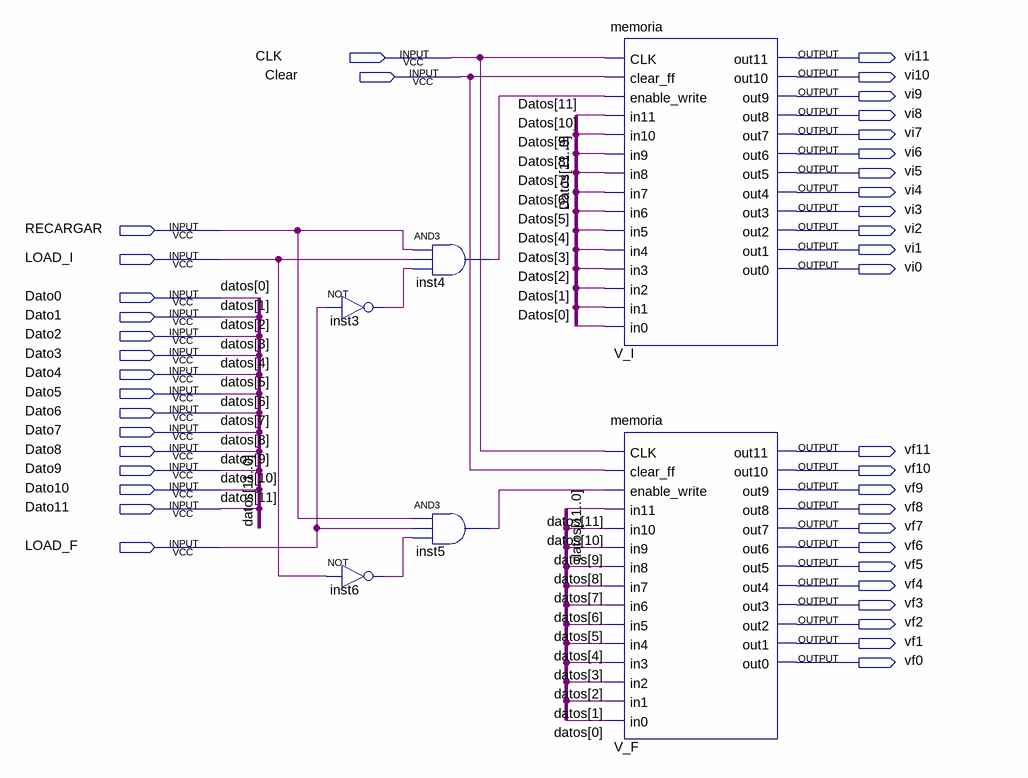
[diagram p0: schematic sheet]
// Quartus schematic Cargador.bdf as structural Verilog: 6 symbols, 41 pins
module Cargador (
  input  CLK,
  input  Clear,
  input  RECARGAR,
  input  LOAD_I,
  input  Dato0,
  input  Dato1,
  input  Dato2,
  input  Dato3,
  input  Dato4,
  input  Dato5,
  input  Dato6,
  input  Dato7,
  input  Dato8,
  input  Dato9,
  input  Dato10,
  input  Dato11,
  input  LOAD_F,
  output vi11,
  output vi10,
  output vi9,
  output vi8,
  output vi7,
  output vi6,
  output vi5,
  output vi4,
  output vi3,
  output vi2,
  output vi1,
  output vi0,
  output vf11,
  output vf10,
  output vf9,
  output vf8,
  output vf7,
  output vf6,
  output vf5,
  output vf4,
  output vf3,
  output vf2,
  output vf1,
  output vf0
);

  wire inst3_out, inst4_out, inst5_out, inst6_out;

  not inst3 (inst3_out, LOAD_F);
  not inst6 (inst6_out, LOAD_I);
  and inst4 (inst4_out, RECARGAR, LOAD_I, inst3_out);
  and inst5 (inst5_out, RECARGAR, LOAD_F, inst6_out);
  memoria V_I (
    .CLK(CLK), .clear_ff(Clear), .enable_write(inst4_out), .in11(Dato11), .in10(Dato10), .in9(Dato9),
    .in8(Dato8), .in7(Dato7), .in6(Dato6), .in5(Dato5), .in4(Dato4), .in3(Dato3), .in2(Dato2), .in1(Dato1),
    .in0(Dato0), .out11(vi11), .out10(vi10), .out9(vi9), .out8(vi8), .out7(vi7), .out6(vi6), .out5(vi5),
    .out4(vi4), .out3(vi3), .out2(vi2), .out1(vi1), .out0(vi0));
  memoria V_F (
    .CLK(CLK), .clear_ff(Clear), .enable_write(inst5_out), .in11(Dato11), .in10(Dato10), .in9(Dato9),
    .in8(Dato8), .in7(Dato7), .in6(Dato6), .in5(Dato5), .in4(Dato4), .in3(Dato3), .in2(Dato2), .in1(Dato1),
    .in0(Dato0), .out11(vf11), .out10(vf10), .out9(vf9), .out8(vf8), .out7(vf7), .out6(vf6), .out5(vf5),
    .out4(vf4), .out3(vf3), .out2(vf2), .out1(vf1), .out0(vf0));

  // Other names for the same wires on the sheet: datos[11:0] = {Dato11, Dato10, Dato9, Dato8, Dato7, Dato6, Dato5, Dato4, Dato3, Dato2, Dato1, Dato0}
endmodule
